# Altium schematic sheet yuanli.SchDoc
size A4
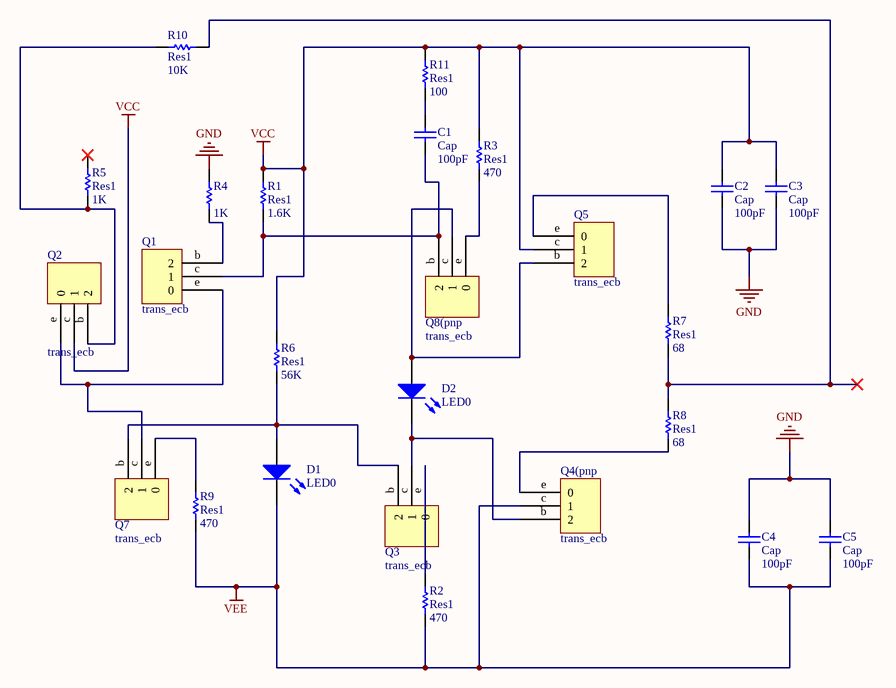
[diagram p0: yuanli.SchDoc]

## Parts
C1  Cap  value 100pF  [RAD-0.1]
C2  Cap  value 100pF  [RAD-0.1]
C3  Cap  value 100pF  [RAD-0.1]
C4  Cap  value 100pF  [RAD-0.1]
C5  Cap  value 100pF  [RAD-0.1]
D1  LED0  [RAD-0.1]
D2  LED0  [RAD-0.1]
Q1  trans_ecb
Q2  trans_ecb
Q3  trans_ecb
Q4(pnp  trans_ecb
Q5  trans_ecb
Q7  trans_ecb
Q8(pnp  trans_ecb
R1  Res1  value 1.6K  [AXIAL-0.3]
R2  Res1  value 470  [AXIAL-0.3]
R3  Res1  value 470  [AXIAL-0.3]
R4  value 1K  [AXIAL-0.3]
R5  Res1  value 1K  [AXIAL-0.3]
R6  Res1  value 56K  [AXIAL-0.3]
R7  Res1  value 68  [AXIAL-0.3]
R8  Res1  value 68  [AXIAL-0.3]
R9  Res1  value 470  [AXIAL-0.3]
R10  Res1  value 10K  [AXIAL-0.3]
R11  Res1  value 100  [AXIAL-0.3]

## Nets
GND: C2.1 C3.1 C4.2 C5.2 R4.2
VCC: C2.2 C3.2 Q2.c(1) Q5.c(1) R1.2 R3.1 R6.2 R11.2
VEE: C4.1 C5.1 D1.2(K) Q4(pnp.c(1) R2.1 R9.1
NetC1_1: C1.1 Q1.c(1) Q8(pnp.b(2) R1.1
NetC1_2: C1.2 R11.1
NetD1_1: D1.1(A) Q3.b(2) Q7.b(2) R6.1
NetD2_1: D2.1(A) Q5.b(2) Q8(pnp.c(1)
NetD2_2: D2.2(K) Q3.c(1) Q4(pnp.b(2)
NetQ1_b: Q1.b(2) R4.1
NetQ1_e: Q1.e(0) Q2.e(0) Q7.c(1)
NetQ2_b: Q2.b(2) R5.2 R10.1
NetQ3_e: Q3.e(0) R2.2
NetQ4(pnp_e: Q4(pnp.e(0) R8.1
NetQ5_e: Q5.e(0) R7.2
NetQ7_e: Q7.e(0) R9.2
NetQ8(pnp_e: Q8(pnp.e(0) R3.2
NetR7_1: R7.1 R8.2 R10.2

Not connected (* = marked no-connect by the designer): R5 1*

## Library data of the parts
C1-C5 = Cap: Capacitor; Published: 8-Jun-2000; LatestRevisionDate: 17-Jul-2002; LatestRevisionNote: Re-released for DXP Platform.; PackageReference: RAD-0.3; Publisher: Altium Limited; PackageDescription: Radial Cap, Thru-Hole; 2 Leads; 0.3 in Pin Spacing
D1 D2 = LED0: Typical INFRARED GaAs LED; Published: 8-Jun-2000; LatestRevisionDate: 08-Jul-2005; LatestRevisionNote: Mech Layer 1 removed.; PackageReference: LED-0; Publisher: Altium Limited; PackageDescription: LED; 2 Leads
R1-R11 = Res1: Resistor; Published: 8-Jun-2000; LatestRevisionDate: 17-Jul-2002; LatestRevisionNote: Re-released for DXP Platform.; PackageReference: AXIAL-0.3; Publisher: Altium Limited; PackageDescription: Axial Device, Thru-Hole; 2 Leads; 0.3 in Pin Spacing